# Altium project 足底压力.PrjPcb
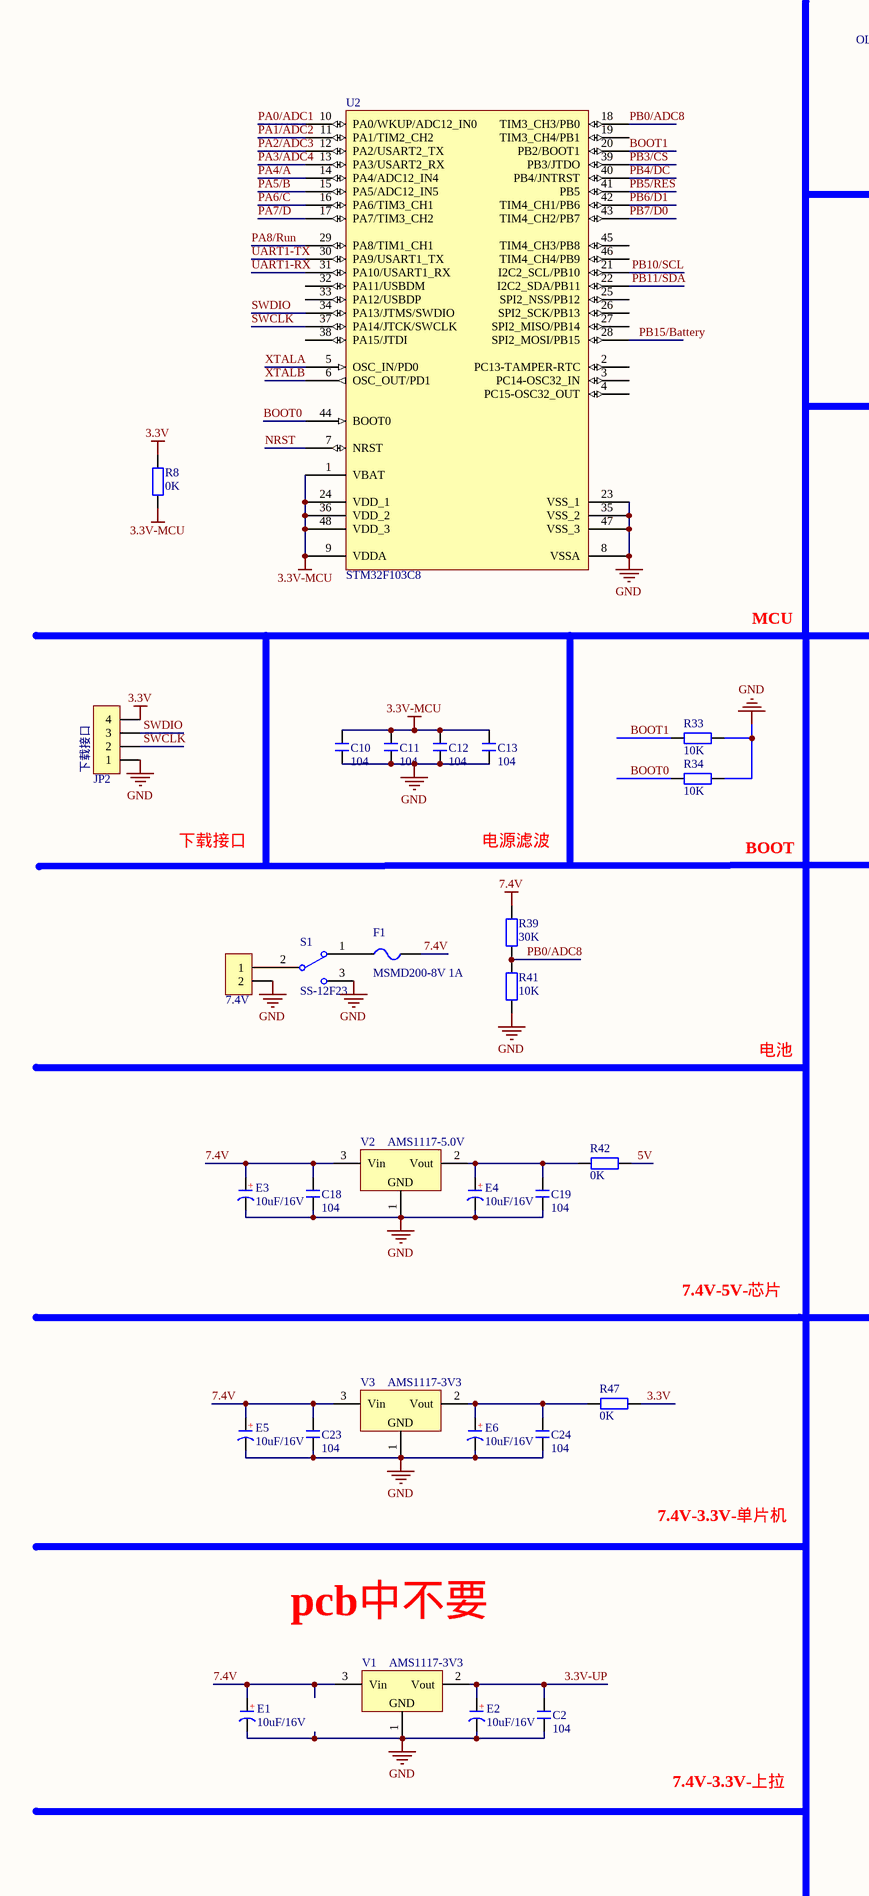
[diagram p0: 足底压力.SchDoc, left]
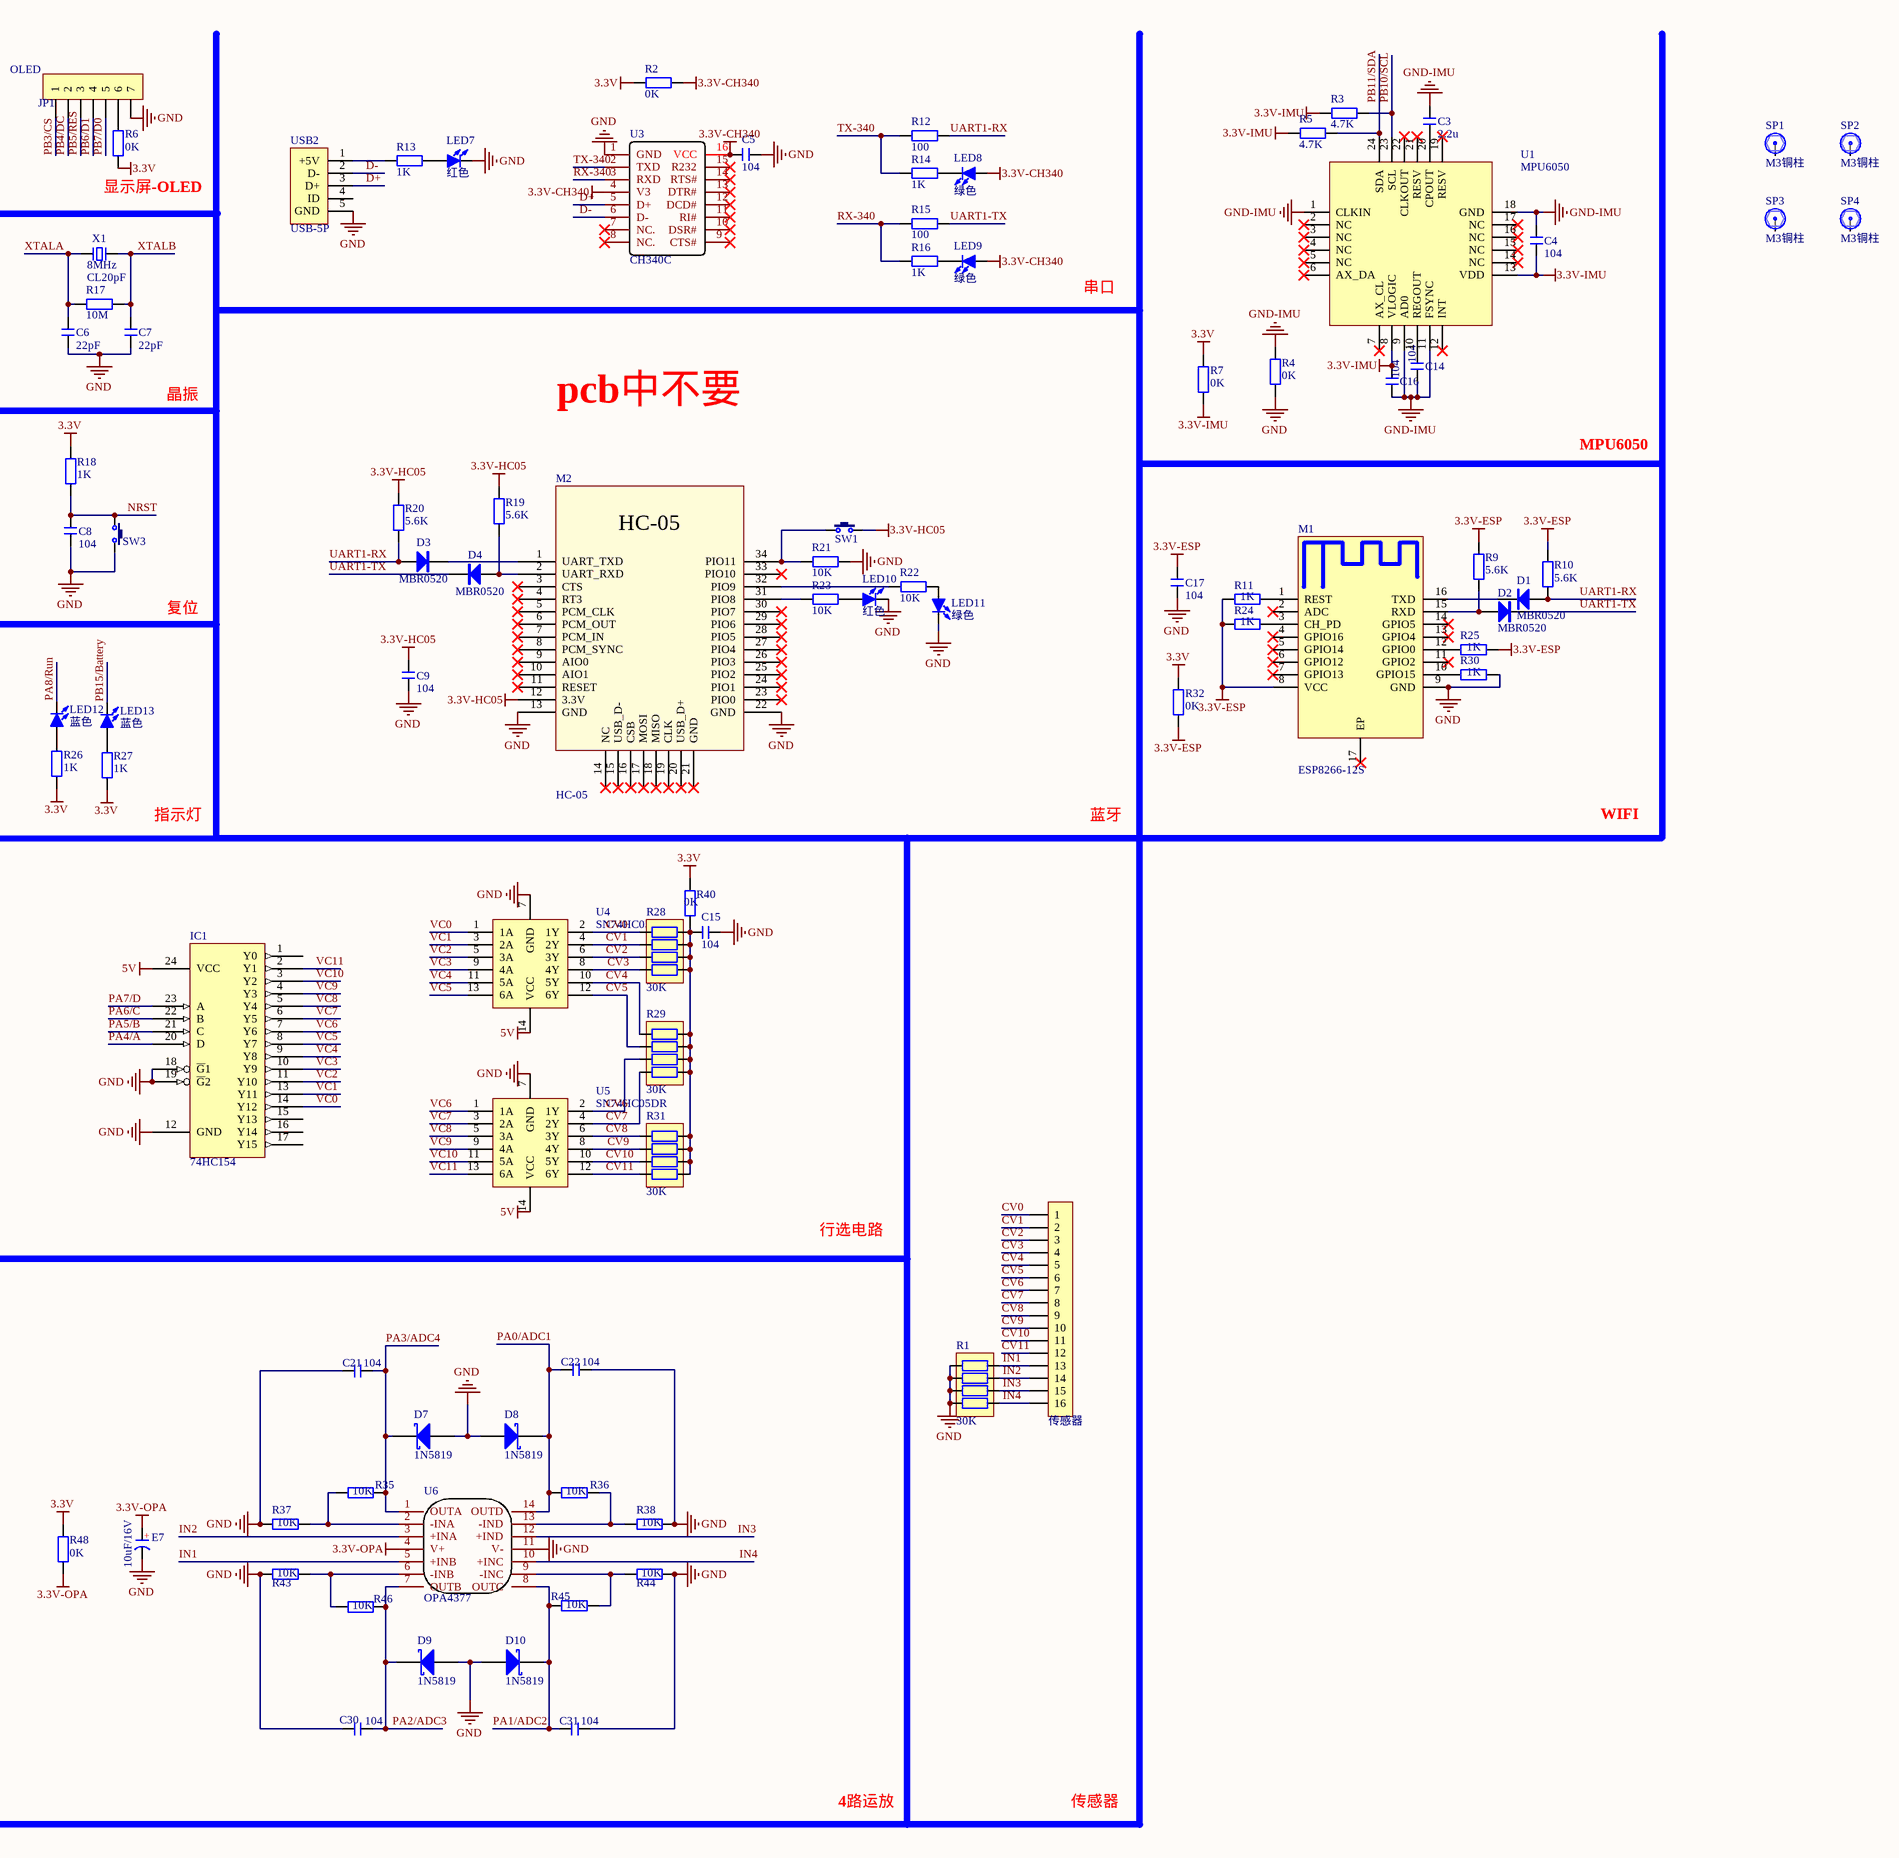
[diagram p1: 足底压力.SchDoc, right]
1 sheet, 120 parts. Net scope: global (net labels, ports and power ports of the same name join across sheets).
Board file: 足底压力.PcbDoc

## Sheet 足底压力.SchDoc
size A2

### Parts
7.4V  HDR-1X2  [XH2.54-WI-2P]  (value not drawn)
C2  104  [C 0603_L]
C3  2.2u  [C 0603_L]
C4  104  [C 0603_L]
C5  104  [C 0603_L]
C6  22pF  [C 0603_L]
C7  22pF  [C 0603_L]
C8  104  [C 0603_L]
C9  104  [C 0805_L]
C10  104  [C 0603_L]
C11  104  [C 0603_L]
C12  104  [C 0603_L]
C13  104  [C 0603_L]
C14  104  [C 0603_L]
C15  104  [C 0603_L]
C16  104  [C 0603_L]
C17  104  [C 0603_L]
C18  104  [C 0603_L]
C19  104  [C 0603_L]
C21  104  [C 0603_L]
C22  104  [C 0603_L]
C23  104  [C 0603_L]
C24  104  [C 0603_L]
C30  104  [C 0603_L]
C31  104  [C 0603_L]
D1  MBR0520  [SOD-123]
D2  MBR0520  [SOD-123]
D3  MBR0520  [SOD-123]
D4  MBR0520  [SOD-123]
D7  1N5819  [SOD-123]
D8  1N5819  [SOD-123]
D9  1N5819  [SOD-123]
D10  1N5819  [SOD-123]
E1  10uF/16V  [CD A(3216)]
E2  10uF/16V  [CD A(3216)]
E3  10uF/16V  [CD A(3216)]
E4  10uF/16V  [CD A(3216)]
E5  10uF/16V  [CD A(3216)]
E6  10uF/16V  [CD A(3216)]
E7  10uF/16V  [CD A(3216)]
F1  MSMD200-8V 1A  [FU 1206]
IC1  74HC154  [SOP24_N]
JP1  HDR-1X7  [HDR2.54-M-LI-7P]  (value not drawn)
JP2  HDR-1X4  [HDR2.54-LI-4P]  (value not drawn)
LED7  红色  [LED 0603R]
LED8  绿色  [LED 0603G]
LED9  绿色  [LED 0603G]
LED10  红色  [LED 0805R]
LED11  绿色  [LED 0805G]
LED12  蓝色  [LED 0603B]
LED13  蓝色  [LED 0603B]
M1  ESP8266-12S  [ESP8266-12S]
M2  HC-05  [HC-05]
R1  30K  [RCA-8P4R-0603]
R2  0K  [R 0402_L]
R3  4.7K  [R 0603_L]
R4  0K  [R 0402_L]
R5  4.7K  [R 0603_L]
R6  0K  [R 0402_L]
R7  0K  [R 0402_L]
R8  0K  [R 0402_L]
R9  5.6K  [R 0603_L]
R10  5.6K  [R 0603_L]
R11  1K  [R 0603_L]
R12  100  [R 0603_L]
R13  1K  [R 0603_L]
R14  1K  [R 0603_L]
R15  100  [R 0603_L]
R16  1K  [R 0603_L]
R17  10M  [R 0603_L]
R18  1K  [R 0603_L]
R19  5.6K  [R 0805_L]
R20  5.6K  [R 0805_L]
R21  10K  [R 0805_L]
R22  10K  [R 0805_L]
R23  10K  [R 0805_L]
R24  1K  [R 0603_L]
R25  1K  [R 0603_L]
R26  1K  [R 0603_L]
R27  1K  [R 0603_L]
R28  30K  [RCA-8P4R-0603]
R29  30K  [RCA-8P4R-0603]
R30  1K  [R 0603_L]
R31  30K  [RCA-8P4R-0603]
R32  0K  [R 0402_L]
R33  10K  [R 0603_L]
R34  10K  [R 0603_L]
R35  10K  [R 0603_L]
R36  10K  [R 0603_L]
R37  10K  [R 0603_L]
R38  10K  [R 0603_L]
R39  30K  [R 0603_L]
R40  0K  [R 0402_L]
R41  10K  [R 0603_L]
R42  0K  [R 0402_L]
R43  10K  [R 0603_L]
R44  10K  [R 0603_L]
R45  10K  [R 0603_L]
R46  10K  [R 0603_L]
R47  0K  [R 0402_L]
R48  0K  [R 0402_L]
S1  SS-12F23  [SK-12D07VG3]
SP1  M3铜柱  [M3x20_L]
SP2  M3铜柱  [M3x20_L]
SP3  M3铜柱  [M3x20_L]
SP4  M3铜柱  [M3x20_L]
SW1  3x6x5  [TSW SMD-3*6*2.5]  (value not drawn)
SW3  3x6x5  [TSW SMD-3*6*2.5]  (value not drawn)
U1  MPU6050  [QFN24 4x4_L]
U2  STM32F103C8  [LQFP48 7X7_L]
U3  CH340C  [SOP16]
U4  SN74HC05DR  [SOP14]
U5  SN74HC05DR  [SOP14]
U6  OPA4377  [TSSOP14_L]
USB2  USB-5P  [USB-MICRO_A]
V1  AMS1117-3V3  [SOT223_L]
V2  AMS1117-5.0V  [SOT223_L]
V3  AMS1117-3V3  [SOT223_L]
X1  8MHz  负载电容: CL20pF  [OSC 5032-2P]
传感器  HDR-1X16  [XH2.54-WI-16P]  (value not drawn)

### Nets
3.3V: JP2.4 R2.2 R6.1 R7.2 R8.2 R18.2 R26.2 R27.2 R32.2 R40.2 R47.2 R48.1
3.3V-CH340: C5.1 LED8.1(A) LED9.1(A) R2.1 U3.4(V3) U3.16(VCC)
3.3V-ESP: C17.2 M1.8(VCC) R9.2 R10.2 R11.2 R24.2 R25.1 R32.1
3.3V-HC05: C9.2 M2.12(3.3V) R19.2 R20.2 SW1.2
3.3V-IMU: C4.1 C16.2 R3.1 R5.1 R7.1 U1.8(VLOGIC) U1.13(VDD)
3.3V-MCU: C10.2 C11.2 C12.2 C13.2 R8.1 U2.1(VBAT) U2.9(VDDA) U2.24(VDD_1) U2.36(VDD_2) U2.48(VDD_3)
3.3V-OPA: E7.1(A) R48.2 U6.4(V+)
5V: IC1.24(VCC) R42.2 U4.14(VCC) U5.14(VCC)
7.4V: C18.2 C23.2 E1.1(A) E3.1(A) E5.1(A) F1.2 R39.2 V1.3(Vin) V2.3(Vin) V3.3(Vin)
GND: 7.4V.2 C2.1 C5.2 C6.1 C7.1 C8.1 C9.1 C10.1 C11.1 C12.1 C13.1 C15.2 C17.1 C18.1 C19.1 C21.1 C22.2 C23.1 C24.1 C30.2 C31.2 D7.1(A) D8.1(A) D9.1(A) D10.1(A) E1.2(K) E2.2(K) E3.2(K) E4.2(K) E5.2(K) E6.2(K) E7.2(K) IC1.12(GND) IC1.18(~{G}1) IC1.19(~{G}2) JP1.7 JP2.1 LED7.2(K) LED10.2(K) LED11.2(K) M1.9(GND) M2.13(GND) M2.22(GND) R1.1 R1.2 R1.3 R1.4 R4.1 R21.2 R30.1 R33.2 R34.2 R37.2 R38.1 R41.1 R43.1 R44.2 S1.3 SW3.2 U2.8(VSSA) U2.23(VSS_1) U2.35(VSS_2) U2.47(VSS_3) U3.1(GND) U4.7(GND) U5.7(GND) U6.11(V-) USB2.5(GND) V1.1(GND) V2.1(GND) V3.1(GND)
GND-IMU: C3.1 C4.2 C14.1 C16.1 R4.2 U1.1(CLKIN) U1.9(AD0) U1.11(FSYNC) U1.18(GND)
3.3V-UP: C2.2 E2.1(A) V1.2(Vout)
BOOT0: R34.1 U2.44(BOOT0)
BOOT1: R33.1 U2.20(PB2/BOOT1)
CV0: R28.4 U4.2(1Y) 传感器.1
CV1: R28.3 U4.4(2Y) 传感器.2
CV2: R28.2 U4.6(3Y) 传感器.3
CV3: R28.1 U4.8(4Y) 传感器.4
CV4: R29.4 U4.10(5Y) 传感器.5
CV5: R29.3 U4.12(6Y) 传感器.6
CV6: R29.2 U5.2(1Y) 传感器.7
CV7: R29.1 U5.4(2Y) 传感器.8
CV8: R31.4 U5.6(3Y) 传感器.9
CV9: R31.3 U5.8(4Y) 传感器.10
CV10: R31.2 U5.10(5Y) 传感器.11
CV11: R31.1 U5.12(6Y) 传感器.12
D+: U3.5(D+) USB2.3(D+)
D-: U3.6(D-) USB2.2(D-)
IN1: R1.8 U6.5(+INB) 传感器.13
IN2: R1.7 U6.3(+INA) 传感器.14
IN3: R1.6 U6.12(+IND) 传感器.15
IN4: R1.5 U6.10(+INC) 传感器.16
NRST: C8.2 R18.1 SW3.1 U2.7(NRST)
PA0/ADC1: C22.1 D8.2(K) R36.1 U2.10(PA0/WKUP/ADC12_IN0) U6.14(OUTD)
PA1/ADC2: C31.1 D10.2(K) R45.1 U2.11(PA1/TIM2_CH2) U6.8(OUTC)
PA2/ADC3: C30.1 D9.2(K) R46.2 U2.12(PA2/USART2_TX) U6.7(OUTB)
PA3/ADC4: C21.2 D7.2(K) R35.2 U2.13(PA3/USART2_RX) U6.1(OUTA)
PA4/A: IC1.20(D) U2.14(PA4/ADC12_IN4)
PA5/B: IC1.21(C) U2.15(PA5/ADC12_IN5)
PA6/C: IC1.22(B) U2.16(PA6/TIM3_CH1)
PA7/D: IC1.23(A) U2.17(PA7/TIM3_CH2)
PA8/Run: LED12.2(K) U2.29(PA8/TIM1_CH1)
PB0/ADC8: R39.1 R41.2 U2.18(TIM3_CH3/PB0)
PB3/CS: JP1.1 U2.39(PB3/JTDO)
PB4/DC: JP1.2 U2.40(PB4/JNTRST)
PB5/RES: JP1.3 U2.41(PB5)
PB6/D1: JP1.4 U2.42(TIM4_CH1/PB6)
PB7/D0: JP1.5 U2.43(TIM4_CH2/PB7)
PB10/SCL: R3.2 U1.23(SCL) U2.21(I2C2_SCL/PB10)
PB11/SDA: R5.2 U1.24(SDA) U2.22(I2C2_SDA/PB11)
PB15/Battery: LED13.2(K) U2.28(SPI2_MOSI/PB15)
RX-340: R15.1 R16.1 U3.3(RXD)
SWCLK: JP2.2 U2.37(PA14/JTCK/SWCLK)
SWDIO: JP2.3 U2.34(PA13/JTMS/SWDIO)
TX-340: R12.1 R14.1 U3.2(TXD)
UART1-RX: D1.1(A) D3.1(A) R10.1 R12.2 R20.1 U2.31(PA10/USART1_RX)
UART1-TX: D2.2(K) D4.2(K) R15.2 U2.30(PA9/USART1_TX)
VC0: IC1.14(Y12) U4.1(1A)
VC1: IC1.13(Y11) U4.3(2A)
VC2: IC1.11(Y10) U4.5(3A)
VC3: IC1.10(Y9) U4.9(4A)
VC4: IC1.9(Y8) U4.11(5A)
VC5: IC1.8(Y7) U4.13(6A)
VC6: IC1.7(Y6) U5.1(1A)
VC7: IC1.6(Y5) U5.3(2A)
VC8: IC1.5(Y4) U5.5(3A)
VC9: IC1.4(Y3) U5.9(4A)
VC10: IC1.3(Y2) U5.11(5A)
VC11: IC1.2(Y1) U5.13(6A)
XTALA: C6.2 R17.1 U2.5(OSC_IN/PD0) X1.1
XTALB: C7.2 R17.2 U2.6(OSC_OUT/PD1) X1.2
Net7.4V_1: 7.4V.1 S1.2
NetC3_2: C3.2 U1.20(CPOUT)
NetC14_2: C14.2 U1.10(REGOUT)
NetC15_1: C15.1 R28.5 R28.6 R28.7 R28.8 R29.5 R29.6 R29.7 R29.8 R31.5 R31.6 R31.7 R31.8 R40.1
NetC19_2: C19.2 E4.1(A) R42.1 V2.2(Vout)
NetC24_2: C24.2 E6.1(A) R47.1 V3.2(Vout)
NetD1_2: D1.2(K) M1.16(TXD)
NetD2_1: D2.1(A) M1.15(RXD) R9.1
NetD3_2: D3.2(K) M2.1(UART_TXD)
NetD4_1: D4.1(A) M2.2(UART_RXD) R19.1
NetF1_1: F1.1 S1.1
NetJP1_6: JP1.6 R6.2
NetLED7_1: LED7.1(A) R13.1
NetLED8_2: LED8.2(K) R14.2
NetLED9_2: LED9.2(K) R16.2
NetLED10_1: LED10.1(A) R23.2
NetLED11_1: LED11.1(A) R22.2
NetLED12_1: LED12.1(A) R26.1
NetLED13_1: LED13.1(A) R27.1
NetM1_1: M1.1(REST) R11.1
NetM1_3: M1.3(CH_PD) R24.1
NetM1_10: M1.10(GPIO15) R30.2
NetM1_12: M1.12(GPIO0) R25.2
NetM2_31: M2.31(PIO8) R23.1
NetM2_32: M2.32(PIO9) R22.1
NetM2_34: M2.34(PIO11) R21.1 SW1.1
NetR13_2: R13.2 USB2.1(+5V)
NetR35_1: R35.1 R37.1 U6.2(-INA)
NetR36_2: R36.2 R38.2 U6.13(-IND)
NetR43_2: R43.2 R46.1 U6.6(-INB)
NetR44_1: R44.1 R45.2 U6.9(-INC)

Not connected (* = marked no-connect by the designer): IC1 1(Y0) 15(Y13) 16(Y14) 17(Y15); M1 2(ADC)* 4(GPIO16)* 5(GPIO14)* 6(GPIO12)* 7(GPIO13)* 11(GPIO2)* 13(GPIO4)* 14(GPIO5)* 17(EP)*; M2 3(CTS)* 4(RT3)* 5(PCM_CLK)* 6(PCM_OUT)* 7(PCM_IN)* 8(PCM_SYNC)* 9(AIO0)* 10(AIO1)* 11(RESET)* 14(NC)* 15(USB_D-)* 16(CSB)* 17(MOSI)* 18(MISO)* 19(CLK)* 20(USB_D+)* 21(GND)* 23(PIO0)* 24(PIO1)* 25(PIO2)* 26(PIO3)* 27(PIO4)* 28(PIO5)* 29(PIO6)* 30(PIO7)* 33(PIO10)*; SP1 1; SP2 1; SP3 1; SP4 1; U1 2(NC)* 3(NC)* 4(NC)* 5(NC)* 6(AX_DA)* 7(AX_CL)* 12(INT)* 14(NC)* 15(NC)* 16(NC)* 17(NC)* 19(RESV)* 21(RESV)* 22(CLKOUT)*; U2 2(PC13-TAMPER-RTC) 3(PC14-OSC32_IN) 4(PC15-OSC32_OUT) 19(TIM3_CH4/PB1) 25(SPI2_NSS/PB12) 26(SPI2_SCK/PB13) 27(SPI2_MISO/PB14) 32(PA11/USBDM) 33(PA12/USBDP) 38(PA15/JTDI) 45(TIM4_CH3/PB8) 46(TIM4_CH4/PB9); U3 7(NC.)* 8(NC.)* 9(CTS#)* 10(DSR#)* 11(RI#)* 12(DCD#)* 13(DTR#)* 14(RTS#)* 15(R232)*; USB2 4(ID)

### Notes on the sheet
- (near JP1) OLED
- (near R6) 显示屏-OLED
- 串口
- 晶振
- pcb中不要
- MPU6050
- MCU
- 复位
- (near JP2) 下载接口
- 下载接口
- 电源滤波
- BOOT
- 指示灯
- 蓝牙
- WIFI
- 电池
- 7.4V-5V-芯片
- 行选电路
- 7.4V-3.3V-单片机
- 7.4V-3.3V-上拉
- 4路运放
- 传感器
- (in symbol CT) +

### Library data of the parts
7.4V = Header 2: 2P接插件; 版权归属: 封装库来自淘宝 ID：黄晶宝石; BOM名称: 2P接插件; 联系售后: https://shop463601444.taobao.com
C2-C19 C21-C24 C30 C31 = C: 贴片电容; BOM名称: 无极性贴片电容; 淘宝ID: 封装库来自淘宝 ID：黄晶宝石; 联系售后，技术支持: https://shop463601444.taobao.com; 唯一出售店铺网址: https://shop463601444.taobao.com
D1-D4 = 1N4007: 整流二极管; 淘宝ID: 封装库来自淘宝 ID：黄晶宝石; 封装库来自淘宝卖家 ID：黄晶宝石: 其他店铺购入均为盗版，不享受售后技术支持服务，请立即申请退款; BOM名称: 整流二极管; 联系售后，技术支持: https://shop463601444.taobao.com
D7-D10 = 1N5819: 肖特基二极管; 淘宝ID: 封装库来自淘宝 ID：黄晶宝石; 属性: 40V/2A; BOM名称: 肖特基二极管; 欢迎光临: https://shop463601444.taobao.com
E1-E7 = CT: 贴片钽电容; 淘宝ID: 封装库来自淘宝 ID：黄晶宝石; BOM名称: 贴片钽电容; 联系售后: https://shop463601444.taobao.com
F1 = FU: 贴片保险丝; 版权归属: 封装库来自淘宝卖家 ID：黄晶宝石; BOM名称: 贴片保险丝; 学习资源: https://shop463601444.taobao.com
IC1 = 74HC154: 4线转16线译码器; 版权归属: 源创客; BOM名称: 4线转16线译码器; 学习资源: www.ooocke.com
JP1 = Header 7: 7P接插件; 版权归属: 封装库来自淘宝 ID：黄晶宝石; BOM名称: 7P接插件; 学习资源: https://shop463601444.taobao.com
JP2 = Header 4: 4P接插件; 版权归属: 封装库来自淘宝 ID：黄晶宝石; BOM名称: 4P接插件; 学习资源: https://shop463601444.taobao.com
LED7-LED13 = LED-SMD: 贴片LED; 版权归属: 封装库来自淘宝 ID：黄晶宝石; BOM名称: 贴片LED; 学习资源: https://shop463601444.taobao.com
M1 = ESP8266-12S: 立创商城
M2 = HC-05: 串口蓝牙模块; 版权归属: 源创客; BOM名称: 串口蓝牙模块; 学习资源: www.ooocke.com
R1 R28 R29 R31 = R-8P4R: 贴片排阻; BOM名称: 贴片网络排阻; 版权归属: 封装库来自淘宝 ID：黄晶宝石; 联系售后: https://shop463601444.taobao.com
R2-R27 R30 R32-R48 = R: 贴片电阻; 版权归属: 来自淘宝 ID：黄晶宝石; 封装库来自淘宝卖家 ID：黄晶宝石: 其他店铺购入均为盗版，不享受售后技术支持服务，请立即申请退款; BOM名称: 贴片电阻; 联系售后: https://shop463601444.taobao.com
S1 = SSW-1P: 1路波动开关; BOM名称: 波动开关; 版权归属: 源创客; 学习资源: www.ooocke.com
SP1-SP4 = 铜柱小焊盘: 铜柱; 版权归属: 封装库来自淘宝 ID：黄晶宝石; 封装库来自淘宝卖家 ID：黄晶宝石: 其他店铺购入均为盗版，不享受售后技术支持服务，请立即申请退款; BOM名称: 铜柱; 技术支持，联系售后: https://shop463601444.taobao.com
SW1 SW3 = TSW 3x6: 3x6轻触开关; 版权归属: 源创客; BOM名称: 3x6轻触开关; 学习资源: www.ooocke.com
U1 = MPU6050: 数字运动传感器; 版权归属: 源创客; BOM名称: 数字运动传感器; 学习资源: www.ooocke.com
U2 = STM32F103C8: Flaah:64/RAM:20/IO:36; BOM名称: 32位STM单片机; 版权归属: 源创客; 学习资源: www.ooocke.com
U3 = CH340C: 串口芯片，无需外部晶振
U6 = OPA4377: 4路运放
USB2 = USB-5P: 微型USB母座; 版权归属: 源创客; BOM名称: 微型USB母座; 学习资源: www.ooocke.com
V1-V3 = AMS1117: 三端稳压芯片; BOM名称: 稳压芯片; 淘宝ID: 封装库来自淘宝 ID：黄晶宝石; 欢迎光临淘宝店铺: https://shop463601444.taobao.com
X1 = XTAL-2P: 2脚无源脚晶振; 版权归属: 源创客; BOM名称: 2脚无源脚晶振; 学习资源: www.ooocke.com
传感器 = Header 16: 16P接插件; 版权归属: 封装库来自淘宝卖家 ID：黄晶宝石; BOM名称: 16P接插件; 学习资源: https://shop463601444.taobao.com